# Altium schematic sheet LM-008.SchDoc: Main
size Tabloid; DocumentNumber: LM-008; Revision: B; SheetNumber: 2; SheetTotal: 6; DocumentName: LM-008
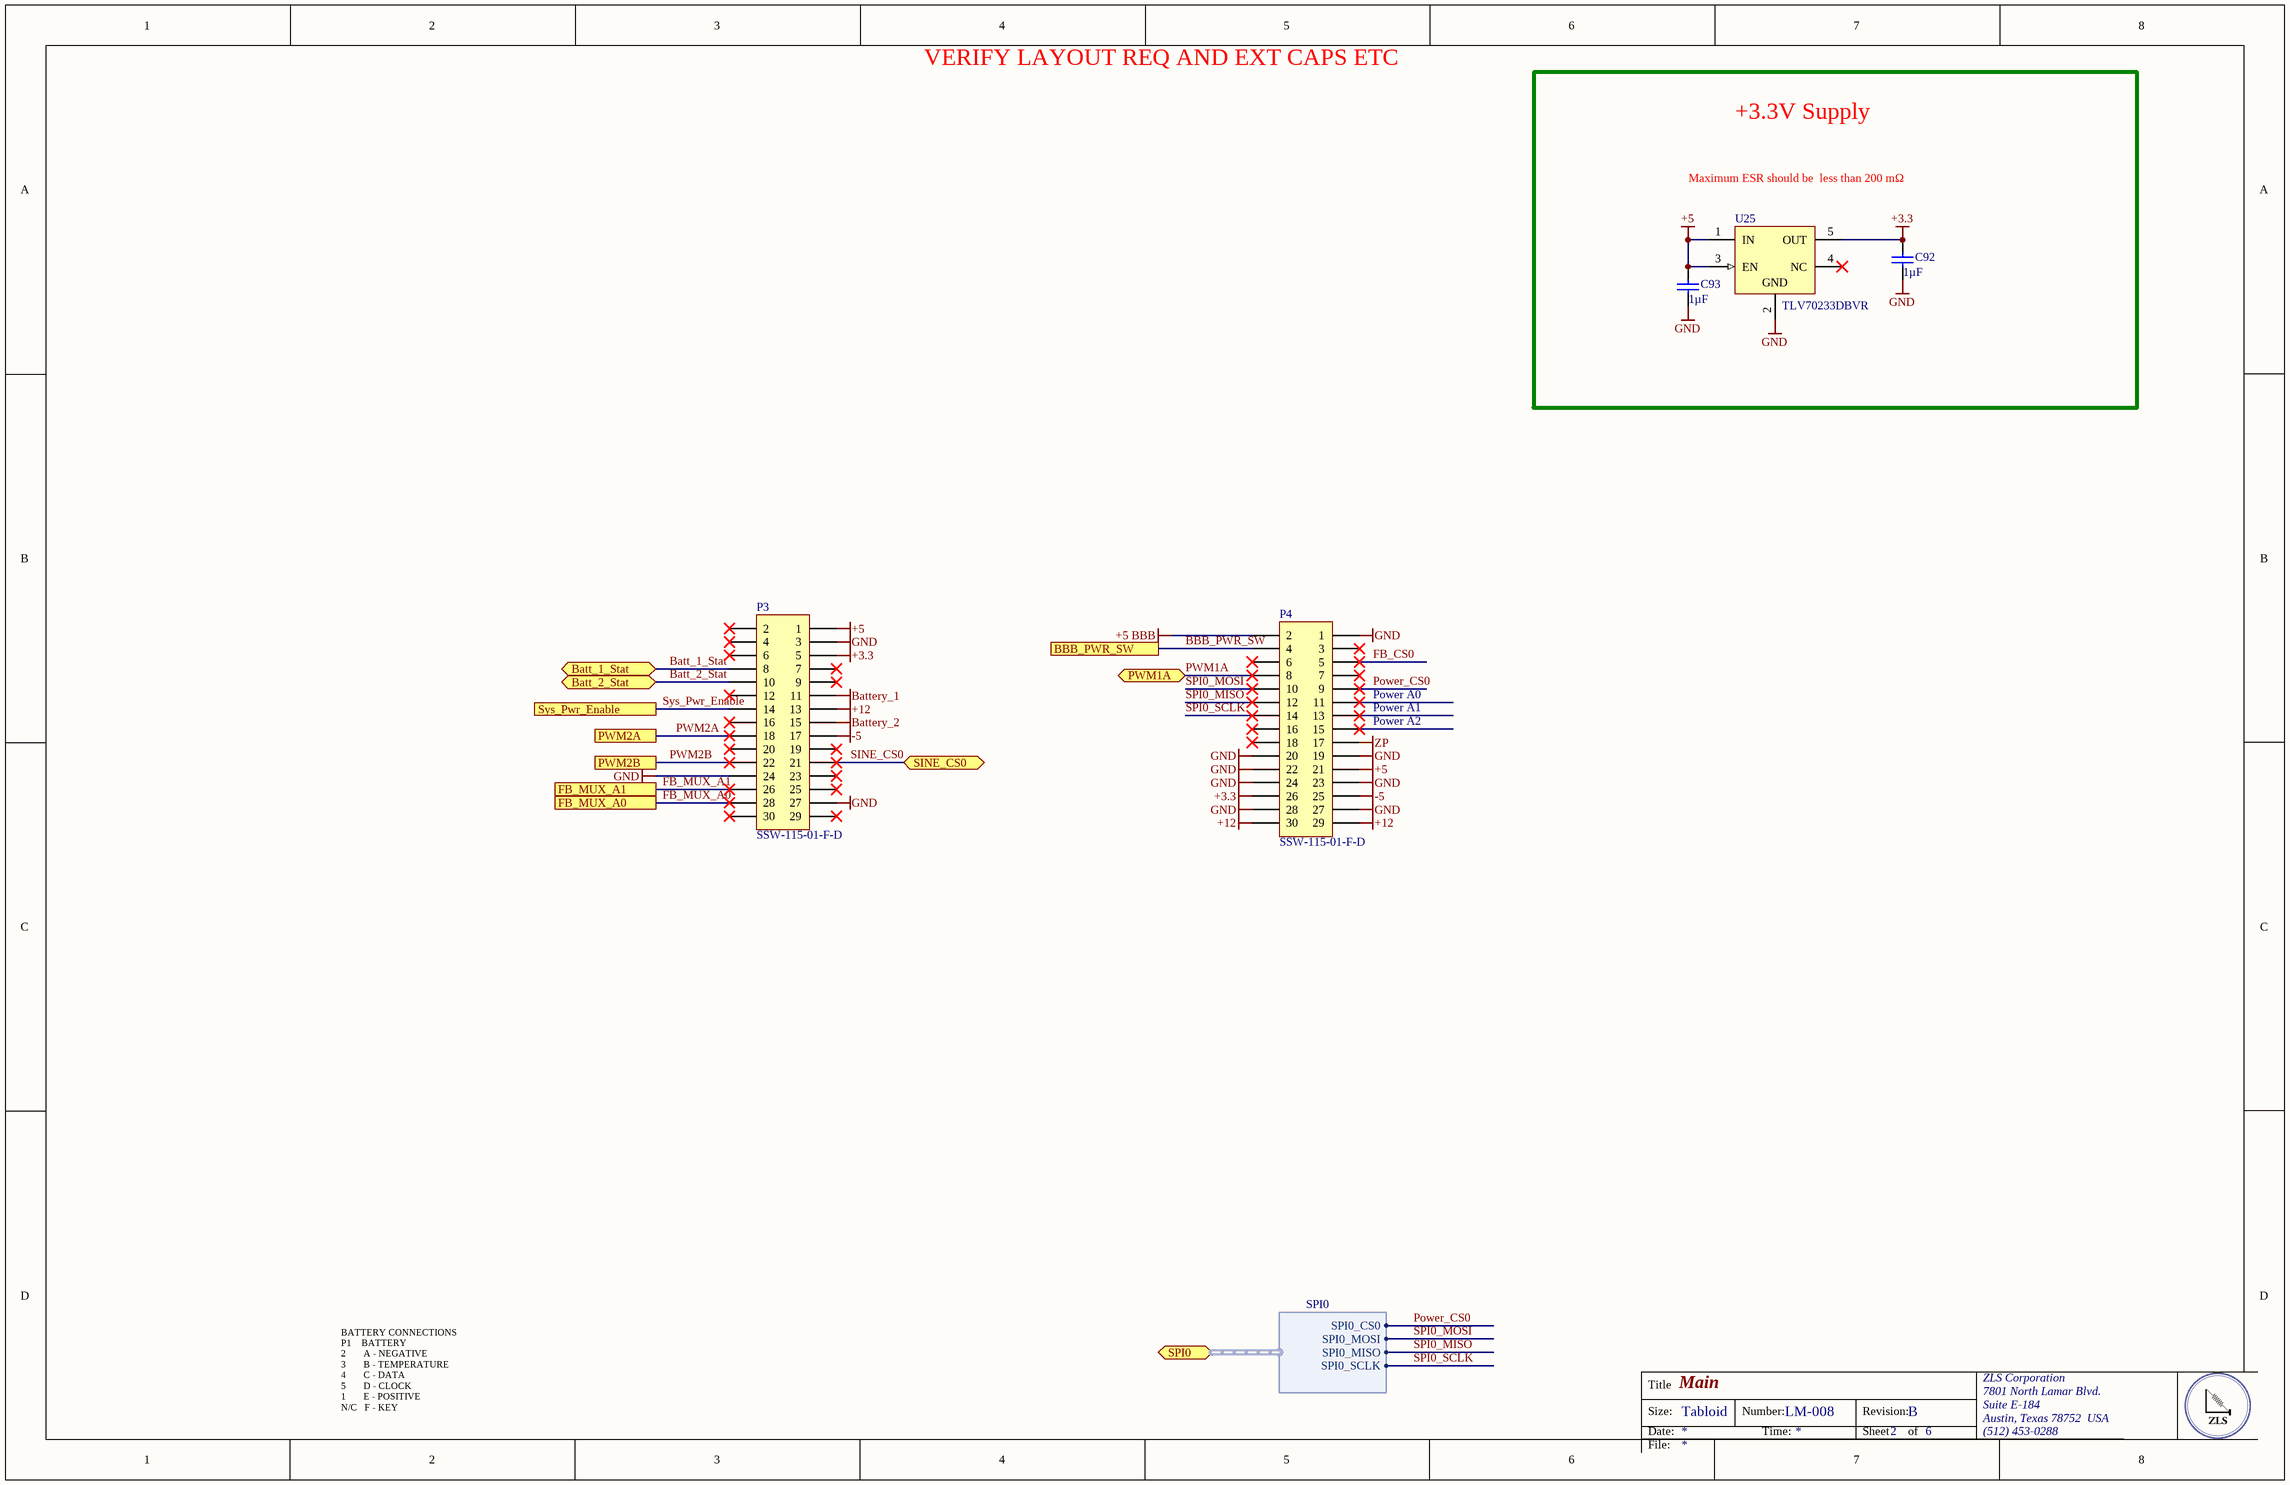
[diagram p0: LM-008.SchDoc]

## Parts
C92  Capacitance: 1µF  [CAPC1206(3216)130_N]  (hidden comment: CAP CER 1UF 50V X7R 1210)
C93  Capacitance: 1µF  [CAPC1206(3216)130_N]  (hidden comment: CAP CER 1UF 50V X7R 1210)
P3  SSW-115-01-F-D  [SSW-115-23-G-D]
P4  SSW-115-01-F-D  [SSW-115-23-G-D]
U25  TLV70233DBVR  [DBV0005A_N]

## Blocks framed on the sheet
+3.3V Supply: C92 C93 U25

## Ports
Batt_1_Stat, Batt_2_Stat, BBB_PWR_SW, FB_MUX_A0, FB_MUX_A1, PWM1A, PWM2A, PWM2B, SINE_CS0, SPI0 (harness SPI0), Sys_Pwr_Enable

## Harnesses
SPI0: SPI0_CS0, SPI0_MOSI, SPI0_MISO, SPI0_SCLK

## Nets
+3.3: C92.2 P3.5 P4.26 U25.5(OUT)
+5: C93.2 P3.1 P4.21 U25.1(IN) U25.3(EN)
+5 BBB: P4.2
+12: P3.13 P4.29 P4.30
-5: P3.17 P4.25
Battery_1: P3.11
Battery_2: P3.15
GND: C92.1 C93.1 P3.3 P3.24 P3.27 P4.1 P4.19 P4.20 P4.22 P4.23 P4.24 P4.27 P4.28 U25.2(GND)
ZP: P4.17
Batt_1_Stat: P3.8 ; port Batt_1_Stat
Batt_2_Stat: P3.10 ; port Batt_2_Stat
BBB_PWR_SW: P4.4 ; port BBB_PWR_SW
FB_CS0: P4.5
FB_MUX_A0: P3.28 ; port FB_MUX_A0
FB_MUX_A1: P3.26 ; port FB_MUX_A1
Power_CS0: P4.9 ; port SPI0.SPI0_CS0
PWM1A: P4.8 ; port PWM1A
PWM2A: P3.18 ; port PWM2A
PWM2B: P3.22 ; port PWM2B
SINE_CS0: P3.21 ; port SINE_CS0
SPI0_MISO: P4.12 ; port SPI0.SPI0_MISO
SPI0_MOSI: P4.10 ; port SPI0.SPI0_MOSI
SPI0_SCLK: P4.14 ; port SPI0.SPI0_SCLK
Sys_Pwr_Enable: P3.14 ; port Sys_Pwr_Enable

Not connected (* = marked no-connect by the designer): P3 2* 4* 6* 7* 9* 12* 16* 19* 20* 23* 25* 29* 30*; P4 3* 6* 7* 11* 13* 15* 16* 18*; U25 4(NC)*

## Notes on the sheet
- VERIFY LAYOUT REQ AND EXT CAPS ETC
- Maximum ESR should be  less than 200 mΩ
- (near P4) Power A0
- (near P4) Power A1
- (near P4) Power A2
- BATTERY CONNECTIONS
  P1    BATTERY
  2       A - NEGATIVE
  3       B - TEMPERATURE
  4       C - DATA
  5       D - CLOCK
  1       E - POSITIVE
  N/C   F - KEY
- Title
- Size:
- Date:
- Tabloid
- Number:
- Time:
- Revision:
- Sheet
- of
- ZLS Corporation
- 7801 North Lamar Blvd.
- Suite E-184
- Austin, Texas 78752  USA
- (512) 453-0288
- File:

## Library data of the parts
C92 C93 = CMP-1037-04913-1: Manufacturer: Murata Electronics North America; Manufacturer Part Number: GRM32RR71H105KA01L; Tolerance: ±10%; Supplier 1: Digi-Key; Supplier Part Number 1: 490-1863-6-ND; RoHS: RoHS Compliant; Category: Capacitors; Stock 1: 66890; Pricing 1: 1=0.35, 10=0.242, 100=0.1449, 500=0.10868 (USD); Packaging: Digi-Reel®; Part Status: Active; Voltage - Rated: 50V; Temperature Coefficient: X7R; Operating Temperature: -55°C ~ 125°C; Features: -; Ratings: -; Applications: General Purpose; Mounting Type: Surface Mount, MLCC; Package / Case: 1210 (3225 Metric); Size / Dimension: 0.126" L x 0.098" W (3.20mm x 2.50mm); Height - Seated (Max): -; Thickness (Max): 0.079" (2.00mm); Lead Spacing: -; Lead Style: -; ComponentLink1URL: http://search.murata.co.jp/Ceramy/image/img/A01X/G101/ENG/GRM32RR71H105KA01-01.pdf; ComponentLink1Description: http://search.murata.co.jp/Ceramy/image/img/A01X/G101/ENG/GRM32RR71H105KA01-01.pdf
P3 P4 = Header 15X2: Header, 15-Pin, Dual row; Manufacturer: Samtec Inc.; Connector Type: Receptacle; Style: Board to Board or Cable; Number of Positions: 30; Number of Positions Loaded: All; Pitch - Mating: 0.100" (2.54mm); Contact Length - Post: 0.104" (2.64mm); Material Flammability Rating: UL94 V-0; Current Rating: 5.7A per Contact; Supplier 1: Digi-Key; Supplier Part Number 1: SAM10034-ND; Manufacturer Part Number: SSW-115-01-F-D; RoHS: RoHS Compliant; Category: Connectors, Interconnects; Stock 1: 119; Pricing 1: 1=3.07, 10=2.596, 100=2.006, 500=1.652, 1000=1.534, 5000=1.4455 (USD); Packaging: Bulk; Part Status: Active; Contact Type: Forked; Row Spacing - Mating: 0.100" (2.54mm); Mounting Type: Through Hole; Termination: Solder; Fastening Type: Push-Pull; Contact Finish - Mating: Gold; Contact Finish Thickness - Mating: 3.00µin (0.076µm); Insulation Color: Black; Insulation Height: 0.335" (8.51mm); Operating Temperature: -55°C ~ 125°C; Contact Finish - Post: Tin; Mated Stacking Heights: -; Ingress Protection: -; Features: -; Voltage Rating: -; Applications: -; Insulation Material: Liquid Crystal Polymer (LCP); Contact Shape: Square; Contact Material: Phosphor Bronze; Contact Finish Thickness - Post: -; ComponentLink1URL: http://suddendocs.samtec.com/prints/ssw-1xx-xx-xxx-x-xx-xxx-xx-mkt.pdf; ComponentLink1Description: http://suddendocs.samtec.com/prints/ssw-1xx-xx-xxx-x-xx-xxx-xx-mkt.pdf
U25 = CMP-0394-00528-2: Single Output LDO, 300 mA, Fixed 3.3 V Output, 2 to 5.5 V Input, with Low IQ, 5-pin SOT-23 (DBV), -40 to 125 degC, Green (RoHS & no Sb/Br); Manufacturer: Texas Instruments; Output Configuration: Positive; Voltage - Input (Max): 5.5V; Voltage - Output (Min/Fixed): 3.3V; Voltage Dropout (Max): 0.38V @ 300mA; Current - Output: 300mA; PSRR: 68dB (1kHz); Control Features: Enable; Protection Features: Over Current, Over Temperature, Reverse Polarity, Under Voltage Lockout (UVLO); Supplier 1: Digi-Key; Supplier Part Number 1: 296-32415-1-ND; Manufacturer Part Number: TLV70233DBVR; RoHS: RoHS Compliant; Category: Integrated Circuits (ICs); Stock 1: 65852; Pricing 1: 1=0.51, 10=0.44, 100=0.3288, 500=0.25832, 1000=0.19961 (USD); Packaging: Cut Tape (CT); Part Status: Active; Output Type: Fixed; Voltage - Output (Max): -; Operating Temperature: -40°C ~ 125°C; Mounting Type: Surface Mount; Package / Case: SC-74A, SOT-753; Supplier Device Package: SOT-23-5; Base Part Number: TLV70233; ComponentLink1URL: http://www.ti.com/lit/ds/symlink/tlv702.pdf; ComponentLink1Description: http://www.ti.com/lit/ds/symlink/tlv702.pdf